# Altium schematic sheet ASCII_11_DDR2.SchDoc: RAM DDR2
size A3; Organization: Lime Microsystems; Address1: Surrey Tech Centre; Address2: Guildford GU2 7YG; Address3: Surray; Address4: United Kingdom; Revision: v1.4; SheetNumber: 11; SheetTotal: 15
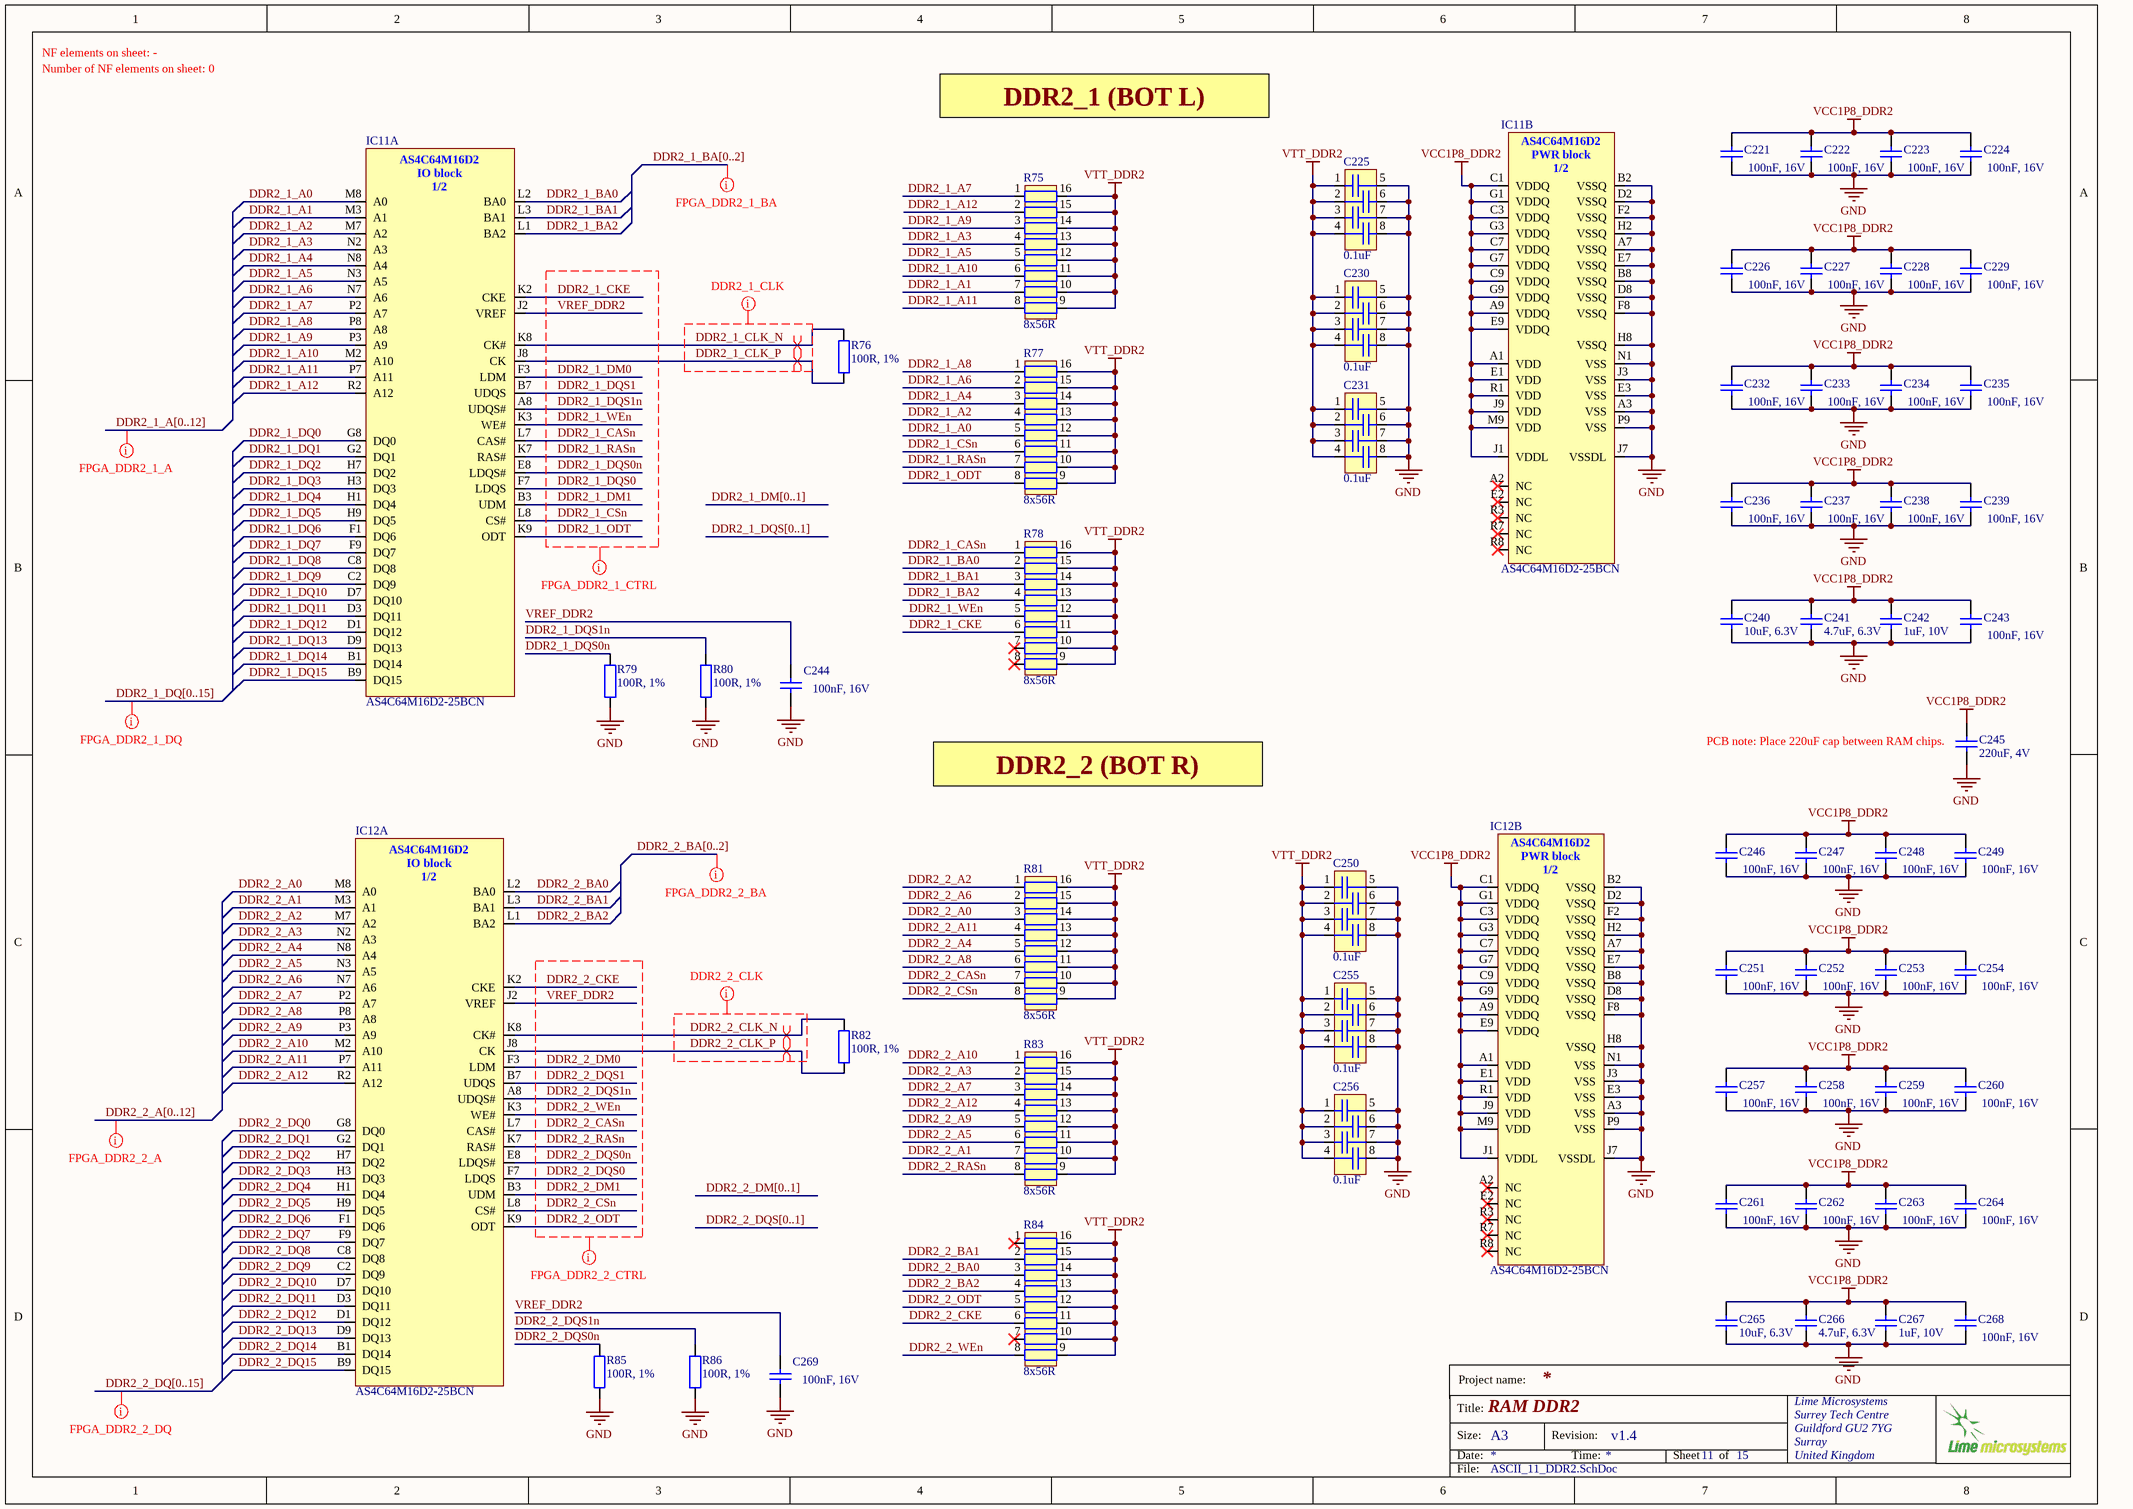
[diagram p0: ASCII_11_DDR2.SchDoc]

## Parts
C221  100nF, 16V  [CAP0402]
C222  100nF, 16V  [CAP0402]
C223  100nF, 16V  [CAP0402]
C224  100nF, 16V  [CAP0402]
C225  0.1uF  [CKCA43X7R1C104M100AA]
C226  100nF, 16V  [CAP0402]
C227  100nF, 16V  [CAP0402]
C228  100nF, 16V  [CAP0402]
C229  100nF, 16V  [CAP0402]
C230  0.1uF  [CKCA43X7R1C104M100AA]
C231  0.1uF  [CKCA43X7R1C104M100AA]
C232  100nF, 16V  [CAP0402]
C233  100nF, 16V  [CAP0402]
C234  100nF, 16V  [CAP0402]
C235  100nF, 16V  [CAP0402]
C236  100nF, 16V  [CAP0402]
C237  100nF, 16V  [CAP0402]
C238  100nF, 16V  [CAP0402]
C239  100nF, 16V  [CAP0402]
C240  10uF, 6.3V  [CAP0603]
C241  4.7uF, 6.3V  [CAP0402]
C242  1uF, 10V  [CAP0402]
C243  100nF, 16V  [CAP0402]
C244  100nF, 16V  [CAP0402]
C245  220uF, 4V  [CAP1206]
C246  100nF, 16V  [CAP0402]
C247  100nF, 16V  [CAP0402]
C248  100nF, 16V  [CAP0402]
C249  100nF, 16V  [CAP0402]
C250  0.1uF  [CKCA43X7R1C104M100AA]
C251  100nF, 16V  [CAP0402]
C252  100nF, 16V  [CAP0402]
C253  100nF, 16V  [CAP0402]
C254  100nF, 16V  [CAP0402]
C255  0.1uF  [CKCA43X7R1C104M100AA]
C256  0.1uF  [CKCA43X7R1C104M100AA]
C257  100nF, 16V  [CAP0402]
C258  100nF, 16V  [CAP0402]
C259  100nF, 16V  [CAP0402]
C260  100nF, 16V  [CAP0402]
C261  100nF, 16V  [CAP0402]
C262  100nF, 16V  [CAP0402]
C263  100nF, 16V  [CAP0402]
C264  100nF, 16V  [CAP0402]
C265  10uF, 6.3V  [CAP0603]
C266  4.7uF, 6.3V  [CAP0402]
C267  1uF, 10V  [CAP0402]
C268  100nF, 16V  [CAP0402]
C269  100nF, 16V  [CAP0402]
IC11  AS4C64M16D2-25BCN  [AS4C64M16D2]  (parts A,B of 2)
IC12  AS4C64M16D2-25BCN  [AS4C64M16D2]  (parts A,B of 2)
R75  8x56R  [EXB2HV]
R76  100R, 1%  [RES0402]
R77  8x56R  [EXB2HV]
R78  8x56R  [EXB2HV]
R79  100R, 1%  [RES0402]
R80  100R, 1%  [RES0402]
R81  8x56R  [EXB2HV]
R82  100R, 1%  [RES0402]
R83  8x56R  [EXB2HV]
R84  8x56R  [EXB2HV]
R85  100R, 1%  [RES0402]
R86  100R, 1%  [RES0402]

## Nets
GND: C221.2 C222.2 C223.2 C224.2 C225.5 C225.6 C225.7 C225.8 C226.2 C227.2 C228.2 C229.2 C230.5 C230.6 C230.7 C230.8 C231.5 C231.6 C231.7 C231.8 C232.2 C233.2 C234.2 C235.2 C236.2 C237.2 C238.2 C239.2 C240.1 C241.1 C242.1 C243.2 C244.2 C245.1 C246.2 C247.2 C248.2 C249.2 C250.5 C250.6 C250.7 C250.8 C251.2 C252.2 C253.2 C254.2 C255.5 C255.6 C255.7 C255.8 C256.5 C256.6 C256.7 C256.8 C257.2 C258.2 C259.2 C260.2 C261.2 C262.2 C263.2 C264.2 C265.1 C266.1 C267.1 C268.2 C269.2 IC11.A3(VSS) IC11.A7(VSSQ) IC11.B2(VSSQ) IC11.B8(VSSQ) IC11.D2(VSSQ) IC11.D8(VSSQ) IC11.E3(VSS) IC11.E7(VSSQ) IC11.F2(VSSQ) IC11.F8(VSSQ) IC11.H2(VSSQ) IC11.H8(VSSQ) IC11.J3(VSS) IC11.J7(VSSDL) IC11.N1(VSS) IC11.P9(VSS) IC12.A3(VSS) IC12.A7(VSSQ) IC12.B2(VSSQ) IC12.B8(VSSQ) IC12.D2(VSSQ) IC12.D8(VSSQ) IC12.E3(VSS) IC12.E7(VSSQ) IC12.F2(VSSQ) IC12.F8(VSSQ) IC12.H2(VSSQ) IC12.H8(VSSQ) IC12.J3(VSS) IC12.J7(VSSDL) IC12.N1(VSS) IC12.P9(VSS) R79.1 R80.1 R85.1 R86.1
VCC1P8_DDR2: C221.1 C222.1 C223.1 C224.1 C226.1 C227.1 C228.1 C229.1 C232.1 C233.1 C234.1 C235.1 C236.1 C237.1 C238.1 C239.1 C240.2 C241.2 C242.2 C243.1 C245.2 C246.1 C247.1 C248.1 C249.1 C251.1 C252.1 C253.1 C254.1 C257.1 C258.1 C259.1 C260.1 C261.1 C262.1 C263.1 C264.1 C265.2 C266.2 C267.2 C268.1 IC11.A1(VDD) IC11.A9(VDDQ) IC11.C1(VDDQ) IC11.C3(VDDQ) IC11.C7(VDDQ) IC11.C9(VDDQ) IC11.E1(VDD) IC11.E9(VDDQ) IC11.G1(VDDQ) IC11.G3(VDDQ) IC11.G7(VDDQ) IC11.G9(VDDQ) IC11.J1(VDDL) IC11.J9(VDD) IC11.M9(VDD) IC11.R1(VDD) IC12.A1(VDD) IC12.A9(VDDQ) IC12.C1(VDDQ) IC12.C3(VDDQ) IC12.C7(VDDQ) IC12.C9(VDDQ) IC12.E1(VDD) IC12.E9(VDDQ) IC12.G1(VDDQ) IC12.G3(VDDQ) IC12.G7(VDDQ) IC12.G9(VDDQ) IC12.J1(VDDL) IC12.J9(VDD) IC12.M9(VDD) IC12.R1(VDD)
VTT_DDR2: C225.1 C225.2 C225.3 C225.4 C230.1 C230.2 C230.3 C230.4 C231.1 C231.2 C231.3 C231.4 C250.1 C250.2 C250.3 C250.4 C255.1 C255.2 C255.3 C255.4 C256.1 C256.2 C256.3 C256.4 R75.9 R75.10 R75.11 R75.12 R75.13 R75.14 R75.15 R75.16 R77.9 R77.10 R77.11 R77.12 R77.13 R77.14 R77.15 R77.16 R78.9 R78.10 R78.11 R78.12 R78.13 R78.14 R78.15 R78.16 R81.9 R81.10 R81.11 R81.12 R81.13 R81.14 R81.15 R81.16 R83.9 R83.10 R83.11 R83.12 R83.13 R83.14 R83.15 R83.16 R84.9 R84.10 R84.11 R84.12 R84.13 R84.14 R84.15 R84.16
DDR2_1_A0: IC11.M8(A0) R77.5
DDR2_1_A1: IC11.M3(A1) R75.7
DDR2_1_A2: IC11.M7(A2) R77.4
DDR2_1_A3: IC11.N2(A3) R75.4
DDR2_1_A4: IC11.N8(A4) R77.3
DDR2_1_A5: IC11.N3(A5) R75.5
DDR2_1_A6: IC11.N7(A6) R77.2
DDR2_1_A7: IC11.P2(A7) R75.1
DDR2_1_A8: IC11.P8(A8) R77.1
DDR2_1_A9: IC11.P3(A9) R75.3
DDR2_1_A10: IC11.M2(A10) R75.6
DDR2_1_A11: IC11.P7(A11) R75.8
DDR2_1_A12: IC11.R2(A12) R75.2
DDR2_1_BA0: IC11.L2(BA0) R78.2
DDR2_1_BA1: IC11.L3(BA1) R78.3
DDR2_1_BA2: IC11.L1(BA2) R78.4
DDR2_1_CASn: IC11.L7(CAS#) R78.1
DDR2_1_CKE: IC11.K2(CKE) R78.6
DDR2_1_CLK_N: IC11.K8(CK#) R76.2
DDR2_1_CLK_P: IC11.J8(CK) R76.1
DDR2_1_CSn: IC11.L8(CS#) R77.6
DDR2_1_DM0: IC11.F3(LDM)
DDR2_1_DM1: IC11.B3(UDM)
DDR2_1_DQ0: IC11.G8(DQ0)
DDR2_1_DQ1: IC11.G2(DQ1)
DDR2_1_DQ2: IC11.H7(DQ2)
DDR2_1_DQ3: IC11.H3(DQ3)
DDR2_1_DQ4: IC11.H1(DQ4)
DDR2_1_DQ5: IC11.H9(DQ5)
DDR2_1_DQ6: IC11.F1(DQ6)
DDR2_1_DQ7: IC11.F9(DQ7)
DDR2_1_DQ8: IC11.C8(DQ8)
DDR2_1_DQ9: IC11.C2(DQ9)
DDR2_1_DQ10: IC11.D7(DQ10)
DDR2_1_DQ11: IC11.D3(DQ11)
DDR2_1_DQ12: IC11.D1(DQ12)
DDR2_1_DQ13: IC11.D9(DQ13)
DDR2_1_DQ14: IC11.B1(DQ14)
DDR2_1_DQ15: IC11.B9(DQ15)
DDR2_1_DQS0: IC11.F7(LDQS)
DDR2_1_DQS0n: IC11.E8(LDQS#) R79.2
DDR2_1_DQS1: IC11.B7(UDQS)
DDR2_1_DQS1n: IC11.A8(UDQS#) R80.2
DDR2_1_ODT: IC11.K9(ODT) R77.8
DDR2_1_RASn: IC11.K7(RAS#) R77.7
DDR2_1_WEn: IC11.K3(WE#) R78.5
DDR2_2_A0: IC12.M8(A0) R81.3
DDR2_2_A1: IC12.M3(A1) R83.7
DDR2_2_A2: IC12.M7(A2) R81.1
DDR2_2_A3: IC12.N2(A3) R83.2
DDR2_2_A4: IC12.N8(A4) R81.5
DDR2_2_A5: IC12.N3(A5) R83.6
DDR2_2_A6: IC12.N7(A6) R81.2
DDR2_2_A7: IC12.P2(A7) R83.3
DDR2_2_A8: IC12.P8(A8) R81.6
DDR2_2_A9: IC12.P3(A9) R83.5
DDR2_2_A10: IC12.M2(A10) R83.1
DDR2_2_A11: IC12.P7(A11) R81.4
DDR2_2_A12: IC12.R2(A12) R83.4
DDR2_2_BA0: IC12.L2(BA0) R84.3
DDR2_2_BA1: IC12.L3(BA1) R84.2
DDR2_2_BA2: IC12.L1(BA2) R84.4
DDR2_2_CASn: IC12.L7(CAS#) R81.7
DDR2_2_CKE: IC12.K2(CKE) R84.6
DDR2_2_CLK_N: IC12.K8(CK#) R82.2
DDR2_2_CLK_P: IC12.J8(CK) R82.1
DDR2_2_CSn: IC12.L8(CS#) R81.8
DDR2_2_DM0: IC12.F3(LDM)
DDR2_2_DM1: IC12.B3(UDM)
DDR2_2_DQ0: IC12.G8(DQ0)
DDR2_2_DQ1: IC12.G2(DQ1)
DDR2_2_DQ2: IC12.H7(DQ2)
DDR2_2_DQ3: IC12.H3(DQ3)
DDR2_2_DQ4: IC12.H1(DQ4)
DDR2_2_DQ5: IC12.H9(DQ5)
DDR2_2_DQ6: IC12.F1(DQ6)
DDR2_2_DQ7: IC12.F9(DQ7)
DDR2_2_DQ8: IC12.C8(DQ8)
DDR2_2_DQ9: IC12.C2(DQ9)
DDR2_2_DQ10: IC12.D7(DQ10)
DDR2_2_DQ11: IC12.D3(DQ11)
DDR2_2_DQ12: IC12.D1(DQ12)
DDR2_2_DQ13: IC12.D9(DQ13)
DDR2_2_DQ14: IC12.B1(DQ14)
DDR2_2_DQ15: IC12.B9(DQ15)
DDR2_2_DQS0: IC12.F7(LDQS)
DDR2_2_DQS0n: IC12.E8(LDQS#) R85.2
DDR2_2_DQS1: IC12.B7(UDQS)
DDR2_2_DQS1n: IC12.A8(UDQS#) R86.2
DDR2_2_ODT: IC12.K9(ODT) R84.5
DDR2_2_RASn: IC12.K7(RAS#) R83.8
DDR2_2_WEn: IC12.K3(WE#) R84.8
VREF_DDR2: C244.1 C269.1 IC11.J2(VREF) IC12.J2(VREF)

Not connected (* = marked no-connect by the designer): IC11 A2(NC)* E2(NC)* R3(NC)* R7(NC)* R8(NC)*; IC12 A2(NC)* E2(NC)* R3(NC)* R7(NC)* R8(NC)*; R78 7* 8*; R84 1* 7*

## Buses and harness runs
bus DDR2_1_A[0..12]
bus DDR2_1_BA[0..2]
bus DDR2_1_DM[0..1]
bus DDR2_1_DQ[0..15]
bus DDR2_1_DQS[0..1]
bus DDR2_2_A[0..12]
bus DDR2_2_BA[0..2]
bus DDR2_2_DM[0..1]
bus DDR2_2_DQ[0..15]
bus DDR2_2_DQS[0..1]

## Layout directives
net class FPGA_DDR0_DQ: (no net found under the mark)
net class FPGA_DDR0_BA: (no net found under the mark)
net class FPGA_DDR0_CTRL: DDR2_1_CASn, DDR2_1_CKE, DDR2_1_CSn, DDR2_1_DM0, DDR2_1_DM1, DDR2_1_DQS0, DDR2_1_DQS0n, DDR2_1_DQS1, DDR2_1_DQS1n, DDR2_1_ODT, DDR2_1_RASn, DDR2_1_WEn, VREF_DDR2
net class FPGA_DDR0_A: (no net found under the mark)
net class FPGA_DDR1_DQ: (no net found under the mark)
net class FPGA_DDR1_BA: (no net found under the mark)
net class FPGA_DDR1_CTRL: DDR2_2_CASn, DDR2_2_CKE, DDR2_2_CSn, DDR2_2_DM0, DDR2_2_DM1, DDR2_2_DQS0, DDR2_2_DQS0n, DDR2_2_DQS1, DDR2_2_DQS1n, DDR2_2_ODT, DDR2_2_RASn, DDR2_2_WEn, VREF_DDR2
net class FPGA_DDR1_A: (no net found under the mark)
differential pair: DDR2_1_CLK_N, DDR2_1_CLK_P, DDR2_2_CLK_N, DDR2_2_CLK_P
net class DDR2_1_CK: DDR2_1_CLK_N, DDR2_1_CLK_P, DDR2_2_CLK_N, DDR2_2_CLK_P

## Notes on the sheet
- Number of NF elements on sheet: 0
- NF elements on sheet: -
- DDR2_1 (BOT L)
- DDR2_2 (BOT R)
- (near C245) PCB note: Place 220uF cap between RAM chips.
- Project name:
- Title:
- Size:
- Date:
- A3
- Revision:
- Time:
- Sheet
- of
- File:
- (in symbol AS4C64M16D2-25BCN, part A) AS4C64M16D2 / IO block / 1/2
- (in symbol AS4C64M16D2-25BCN, part B) AS4C64M16D2 / PWR block / 1/2

## Library data of the parts
C221-C224 C226-C229 C232-C239 C243 C244 C246-C249 C251-C254 C257-C264 C268 C269 = Cap_0603: Manufacturer Part Number 1: GRM155R71C104KA88D; Part Description: 0.10µF ±10% 16V X7R Ceramic Capacitor -55°C ~ 125°C Surface Mount, MLCC 0402 (1005 Metric) 0.039" L x 0.020" W (1.00mm x 0.50mm); Brand: Murata Electronics; Tolerance: 10 %; Type: General Purpose MLCC; Capacitance: 0.1 uF; Temperature Coefficient / Code: +/- 15 %; Supplier 1: Mouser; Supplier Part Number 1: 81-GRM155R71C104KA88; Case Code - in: 0402; Manufacturer: Murata Electronics; Category: Multilayer Ceramic Capacitors MLCC - SMD/SMT; Voltage Rating DC: 16 V; Value: 100nF, 16V; Manufacturer Part Number: GRM155R71C104KA88D
C225 C230 C231 C250 C255 C256 = 4X_cap_array_1206: Manufacturer: TDK; Part Description: CAP ARRAY 0.1UF 16V X7R 1206; Case Height: 1 mm; Case Length: 3.2 mm; Case Width: 1.6 mm; Voltage Rating: 16 V; Number of Elements: 4; Tolerance: 20 %; Temperature Coefficient / Code: X7R; Value: 0.1uF; Supplier 1: Mouser; Supplier Part Number 1: 810-CKCA43X7R1C104M; RoHS: RoHS Compliant; Termination Style: SMD/SMT; Brand: TDK; Category: Capacitor Arrays & Networks; Product: Ceramic Capacitor Arrays; Series: CKC; Packaging: Reel; Operating Temperature Range: - 55 C to + 125 C; Manufacturer Part Number 1: CKCA43X7R1C104M100AA; Capacitance: 0.1 uF; Product Category: Capacitor Arrays; Standard Pack Qty: 2000; RoHS - Mouser: Y; Minimum Order Quantity: 1; Reeling: True
C240 C265 = Cap_0603: Manufacturer Part Number 1: CC0603MRX5R5BB106; Part Description: 10µF ±20% 6.3V X5R Ceramic Capacitor -55°C ~ 85°C Surface Mount, MLCC 0603 (1608 Metric) 0.063" L x 0.031" W (1.60mm x 0.80mm); Manufacturer: Yageo; Capacitance: 10µF; Tolerance: ±20%; Supplier 1: Digi-Key; Supplier Part Number 1: 311-1448-2-ND; Package / Case: 0603 (1608 Metric); Category: Capacitors; Voltage - Rated: 6.3V; Value: 10uF, 6.3V
C241 C266 = Cap_0402: Manufacturer: Murata Electronics North America; Manufacturer Part Number: GRM155R60J475ME87D; Part Description: 4.7µF ±20% 6.3V X5R Ceramic Capacitor -55°C ~ 85°C Surface Mount, MLCC 0402 (1005 Metric) 0.039" L x 0.020" W (1.00mm x 0.50mm); Tolerance: ±20%; Capacitance: 4.7µF; Temperature Coefficient: X5R; Lead Style: -; Ratings: -; Height - Seated (Max): -; Thickness (Max): 0.022" (0.55mm); Voltage - Rated: 6.3V; Packaging: Cut Tape (CT); Lead Spacing: -; Category: Capacitors; Supplier Part Number 1: 490-5408-1-ND; Applications: General Purpose; Operating Temperature: -55°C ~ 85°C; Mounting Type: Surface Mount, MLCC; Features: Derating Recommended; RoHS: RoHS Compliant; Supplier 1: Digi-Key; Package / Case: 0402 (1005 Metric); Size / Dimension: 0.039" L x 0.020" W (1.00mm x 0.50mm); Value: 4.7uF, 6.3V
C242 C267 = Cap_0402: Manufacturer Part Number 1: GRM155R61A105KE15J; Manufacturer: TDK; Part Description: 1µF ±10% 10V X5R Ceramic Capacitor -55°C ~ 85°C Surface Mount, MLCC 0402 (1005 Metric) 0.039" L x 0.020" W (1.00mm x 0.50mm); Voltage Rating: 10; Capacitance Tolerance: ± 10%; Product Range: TDK - C Series; Ceramic Capacitor Case: 0402 [1005 Metric]; Capacitance: 1; Dielectric Characteristic: X6; Value: 1uF, 10V; Supplier 1: Newark; Supplier Part Number 1: 490-6298-2-ND; MSL: -; RoHS: YES
C245 = Cap_1206: Manufacturer Part Number: GRM31CR60G227ME11L; Manufacturer: Murata Electronics North America; Part Description: 220µF ±20% 4V X5R Ceramic Capacitor -55°C ~ 85°C Surface Mount, MLCC 1206 (3216 Metric) 0.126" L x 0.063" W (3.20mm x 1.60mm); Capacitance: 220µF; Temperature Coefficient: X5R; Tolerance: ±20%; Package / Case: 1206 (3216 Metric); Supplier 1: Digi-Key; Packaging: Cut Tape (CT); Size / Dimension: 0.126" L x 0.063" W (3.20mm x 1.60mm); Operating Temperature: -55°C ~ 85°C; Voltage - Rated: 4V; Mounting Type: Surface Mount, MLCC; Ratings: -; Supplier Part Number 1: 490-9774-1-ND; Category: Capacitors; Lead Spacing: -; Lead Style: -; Applications: General Purpose; Features: -; Height - Seated (Max): -; Thickness (Max): 0.075" (1.90mm); RoHS: RoHS Compliant; Value: 220uF, 4V; Manufacturer Part Number 1: GRM31CR60G227ME11L
IC11 IC12 = AS4C64M16D2-25BCN: Manufacturer: Alliance Memory, Inc.; Part Description: IC SDRAM 64MX16 1.8V 84-FBGA; Speed: 400MHz; Interface: Parallel; Memory Type: DDR2 SDRAM; Memory Size: 1G (64M x 16); Voltage - Supply: 1.7 V ~ 1.9 V; Format - Memory: RAM; Supplier 1: Digi-Key; Package / Case: 84-TFBGA; Supplier Device Package: 84-FBGA (8x12.5); Manufacturer Part Number 1: AS4C64M16D2-25BCN; RoHS: RoHS Compliant; Operating Temperature: 0°C ~ 70°C; Category: Integrated Circuits (ICs); Packaging: Tray; Supplier Part Number 1: 1450-1158-ND
R75 R77 R78 R81 R83 R84 = 8X_resistor_array_0402: Manufacturer Part Number 1: EXB2HV560JV; Manufacturer: PANASONIC ELECTRONIC COMPONENTS; Part Description: RES ARRAY 8 RES 56 OHM 1506; Supplier 1: Farnell; Supplier Part Number 1: 2060070; RoHS: YES
R76 R79 R80 R82 R85 R86 = Res_0402: Manufacturer Part Number 1: RMCF0402FT100R; Part Description: RES SMD 100 OHM 1% 1/16W 0402; Manufacturer: Stackpole Electronics Inc.; Temperature Coefficient: ±100ppm/°C; Supplier 1: Digi-Key; Supplier Part Number 1: RMCF0402FT100RDKR-ND; Package / Case: 0402 (1005 Metric); Composition: Thick Film; Category: Resistors; Tolerance: ±1%; Value: 100R, 1%